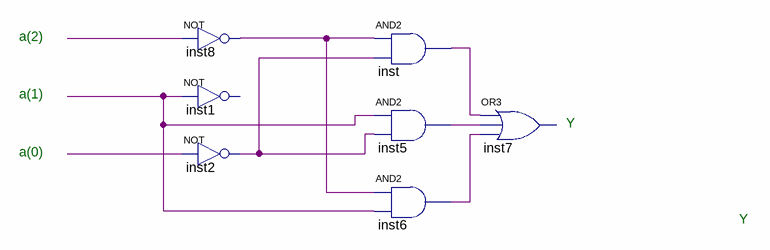
[diagram p0: schematic sheet]
// Quartus schematic Block1.bdf as structural Verilog: 7 symbols, 0 pins
module Block1 (
);

  wire inst2_out, inst5_out, inst6_out, inst8_out, inst_out, undriven, undriven_2, undriven_3;

  not inst8 (inst8_out, undriven_2);
  // NOT inst1 has open pins: IN=undriven_3, OUT=open
  not inst2 (inst2_out, undriven);
  and inst (inst_out, inst8_out, inst2_out);
  and inst5 (inst5_out, undriven_3, inst2_out);
  and inst6 (inst6_out, inst8_out, undriven_3);
  // OR3 inst7 has open pins: IN1=inst_out, IN2=inst5_out, IN3=inst6_out, OUT=open

  // Notes on the sheet:
  //   a(2)
  //   a(1)
  //   Y
  //   a(0)
  //   Y
endmodule
